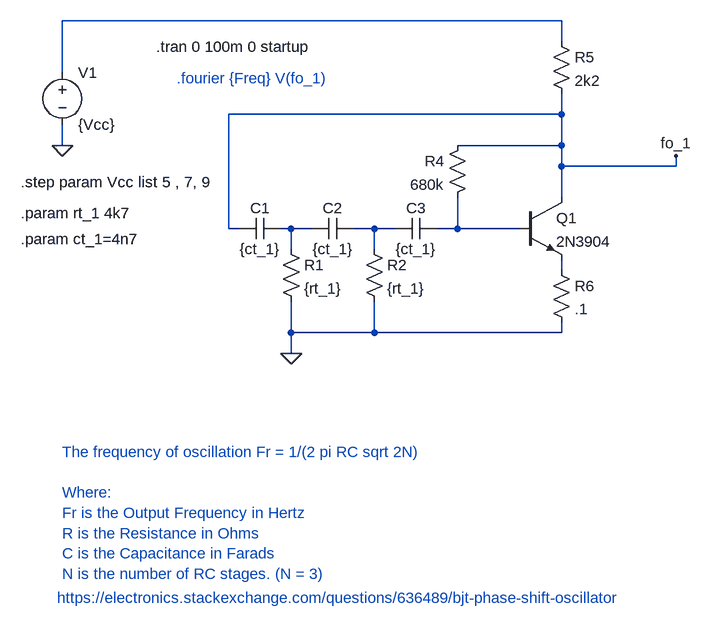
[diagram p0: schematic af_two_tone_0v04.asc]
af_two_tone_0v04.asc, the LTspice schematic file:
Version 4
SHEET 1 880 792
WIRE 464 -112 -304 -112
WIRE 464 -80 464 -112
WIRE -304 -32 -304 -112
WIRE 464 32 464 0
WIRE 464 32 -48 32
WIRE -304 80 -304 48
WIRE 464 80 464 32
WIRE 464 80 304 80
WIRE 464 112 464 80
WIRE 640 112 640 96
WIRE 640 112 464 112
WIRE 464 160 464 112
WIRE -48 208 -48 32
WIRE -32 208 -48 208
WIRE 48 208 32 208
WIRE 80 208 48 208
WIRE 176 208 144 208
WIRE 208 208 176 208
WIRE 304 208 304 160
WIRE 304 208 272 208
WIRE 400 208 304 208
WIRE 48 240 48 208
WIRE 176 240 176 208
WIRE 464 272 464 256
WIRE 48 368 48 320
WIRE 176 368 176 320
WIRE 176 368 48 368
WIRE 464 368 464 352
WIRE 464 368 176 368
WIRE 48 400 48 368
FLAG 48 400 0
FLAG -304 80 0
FLAG 640 96 fo_1
SYMBOL res 32 224 R0
SYMATTR InstName R1
SYMATTR Value {rt_1}
SYMBOL res 160 224 R0
SYMATTR InstName R2
SYMATTR Value {rt_1}
SYMBOL res 320 64 M0
SYMATTR InstName R4
SYMATTR Value 680k
SYMBOL res 448 -96 R0
SYMATTR InstName R5
SYMATTR Value 2k2
SYMBOL cap -32 192 M90
WINDOW 0 0 32 VBottom 2
WINDOW 3 32 32 VTop 2
SYMATTR InstName C1
SYMATTR Value {ct_1}
SYMBOL cap 80 192 M90
WINDOW 0 0 32 VBottom 2
WINDOW 3 32 32 VTop 2
SYMATTR InstName C2
SYMATTR Value {ct_1}
SYMBOL cap 208 192 M90
WINDOW 0 0 32 VBottom 2
WINDOW 3 32 32 VTop 2
SYMATTR InstName C3
SYMATTR Value {ct_1}
SYMBOL npn 400 160 R0
SYMATTR InstName Q1
SYMATTR Value 2N3904
SYMBOL voltage -304 -48 R0
WINDOW 123 0 0 Left 0
WINDOW 39 0 0 Left 0
SYMATTR InstName V1
SYMATTR Value {Vcc}
SYMBOL res 448 256 R0
SYMATTR InstName R6
SYMATTR Value .1
TEXT -368 184 Left 2 !.param rt_1 4k7
TEXT -368 224 Left 2 !.param ct_1=4n7
TEXT -160 -72 Left 2 !.tran 0 100m 0 startup
TEXT -312 776 Left 2 ;https://electronics.stackexchange.com/questions/636489/bjt-phase-shift-oscillator
TEXT -304 552 Left 2 ;The frequency of oscillation Fr = 1/(2 pi RC sqrt 2N)\n \nWhere:\nFr is the Output Frequency in Hertz\nR is the Resistance in Ohms\nC is the Capacitance in Farads\nN is the number of RC stages. (N = 3)
TEXT -368 136 Left 2 !.step param Vcc list 5 , 7, 9
TEXT -128 -24 Left 2 ;.fourier {Freq} V(fo_1)

The netlist it stands for:
* af_two_tone_0v04.asc
R1 N002 0 {rt_1}
R2 N003 0 {rt_1}
R4 fo_1 N004 680k
R5 N001 fo_1 2k2
C1 fo_1 N002 {ct_1}
C2 N002 N003 {ct_1}
C3 N003 N004 {ct_1}
Q1 fo_1 N004 N005 0 2N3904
V1 N001 0 {Vcc}
R6 N005 0 .1
.model NPN NPN
.model PNP PNP
.lib standard.bjt
.param rt_1 4k7
.param ct_1=4n7
.tran 0 100m 0 startup
* https://electronics.stackexchange.com/questions/636489/bjt-phase-shift-oscillator
* The frequency of oscillation Fr = 1/(2 pi RC sqrt 2N)
* Where:
* Fr is the Output Frequency in Hertz
* R is the Resistance in Ohms
* C is the Capacitance in Farads
* N is the number of RC stages. (N = 3)
.step param Vcc list 5 , 7, 9
* .fourier {Freq} V(fo_1)
.backanno
.end